# EAGLE design ft232rl_breakout (EAGLE 6.5.0)
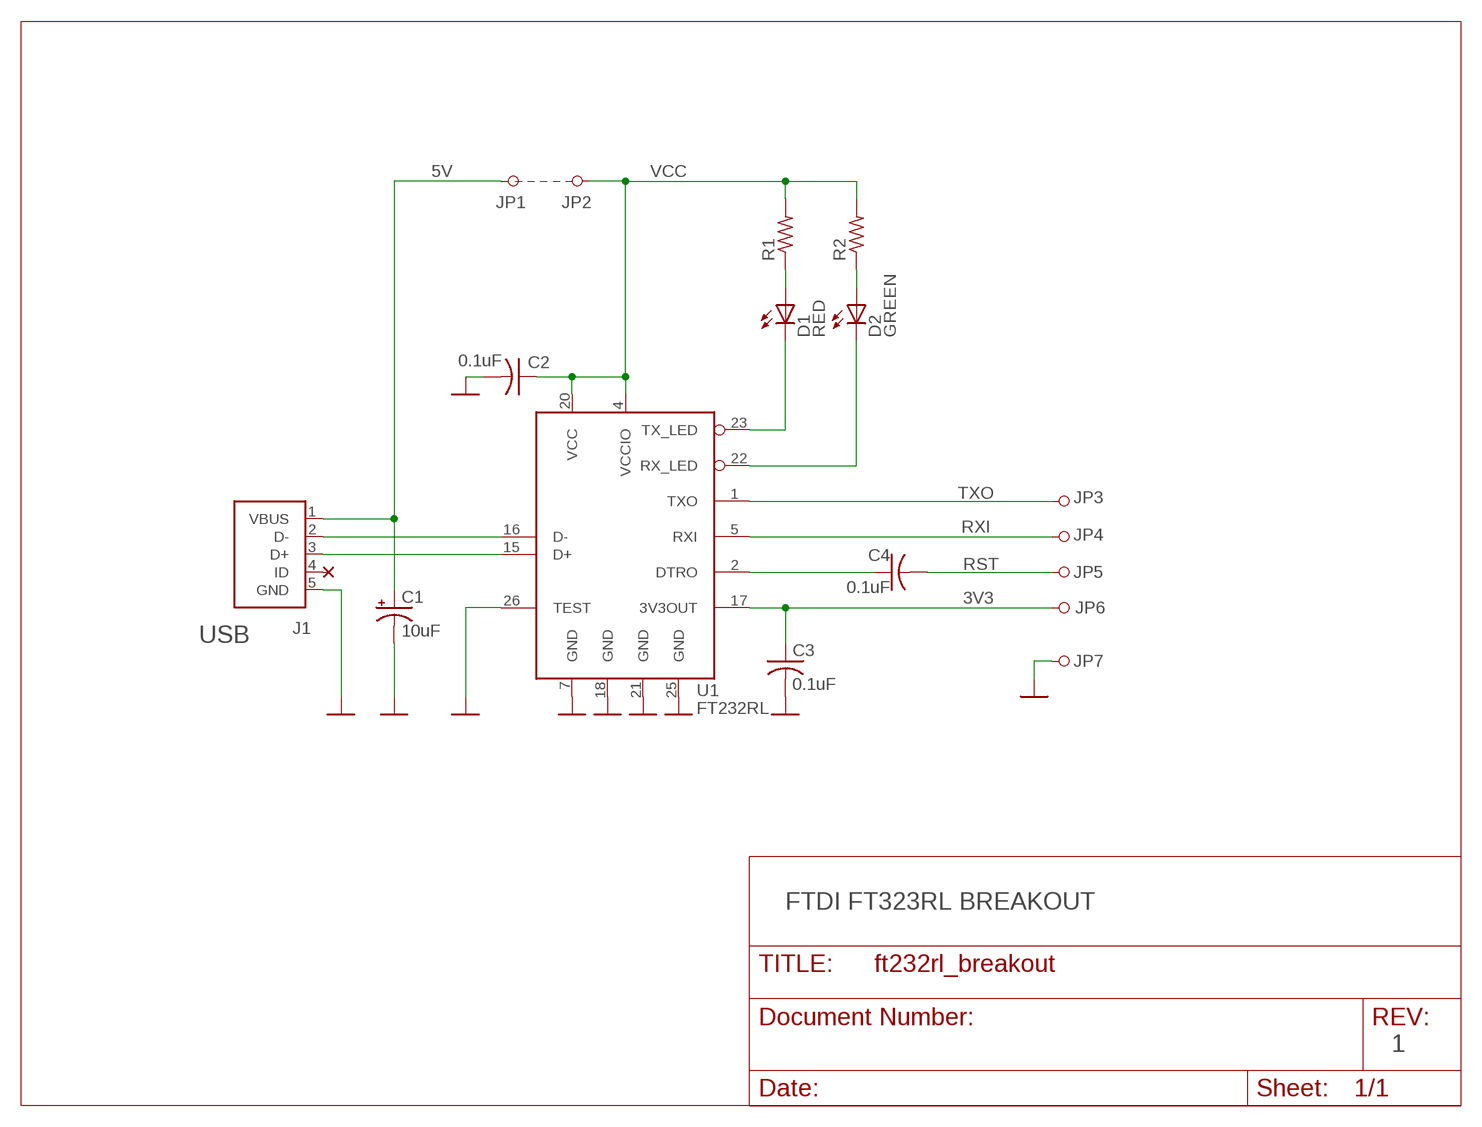
[diagram p0: schematic, sheet 1]

## Parts
C1  10uF  CPOL-USA/3216-18R  [A/3216-18R]
C2  0.1uF  C-USC0402K  [C0402K]
C3  0.1uF  C-USC0402K  [C0402K]
C4  0.1uF  C-USC0402K  [C0402K]
D1  RED  LED  [LED_0402]
D2  GREEN  LED  [LED_0402]
J1  USB  [USB-MICRO-ZX62RD-AB-5P8]
JP1  PINHD-1X1  [1X01]
JP2  PINHD-1X1  [1X01]
JP3  PINHD-1X1  [1X01]
JP4  PINHD-1X1  [1X01]
JP5  PINHD-1X1  [1X01]
JP6  PINHD-1X1  [1X01]
JP7  PINHD-1X1  [1X01]
R1  R-US_R0402  [R0402]
R2  R-US_R0402  [R0402]
U1  FT232RL  [SSOP28DB]

## Nets
3V3: C3.1 JP6.1 U1.17(3V3OUT)
5V: C1.+ J1.1(VBUS) JP1.1
GND: C1.- C2.2 C3.2 J1.5(GND) JP7.1 U1.7(GND) U1.18(GND) U1.21(GND) U1.25(GND) U1.26(TEST)
N$2: D1.C U1.23(TX_LED)
N$3: D2.C U1.22(RX_LED)
N$4: D1.A R1.1
N$5: D2.A R2.1
N$10: J1.3(D+) U1.15(D+)
N$11: C4.1 U1.2(DTRO)
N$15: J1.2(D-) U1.16(D-)
RST: C4.2 JP5.1
RXI: JP4.1 U1.5(RXI)
TXO: JP3.1 U1.1(TXO)
VCC: C2.1 JP2.1 R1.2 R2.2 U1.4(VCCIO) U1.20(VCC)
Unconnected: J1.4(ID)

## Notes on the sheet
- USB
- FTDI FT323RL BREAKOUT
- 1

## Library data of the parts
C1 = ft232rl_breakout:CPOL-US
C2-C4 = ft232rl_breakout:C-US: CAPACITOR, American symbol
D1 D2 = ft232rl_breakout:LED
J1 = ft232rl_breakout:USB
JP1-JP7 = ft232rl_breakout:PINHD-1X1: PIN HEADER
R1 R2 = ft232rl_breakout:R-US_: RESISTOR, American symbol
U1 = ft232rl_breakout:FT232RL

## Net classes
1 power: width 0.254 mm

## Board
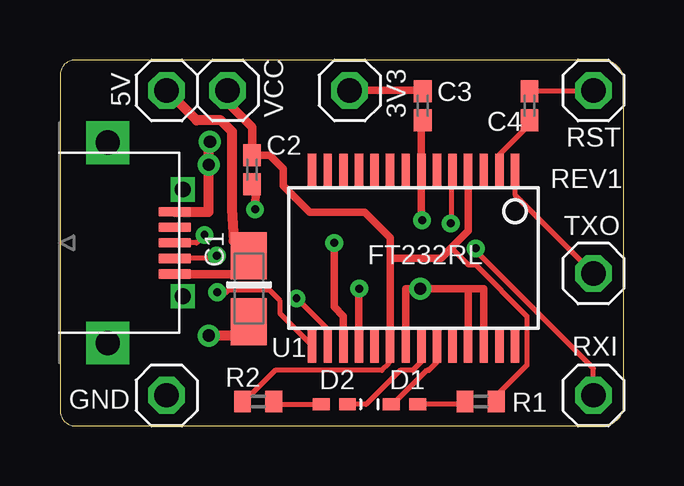
[diagram p1: board, top side]
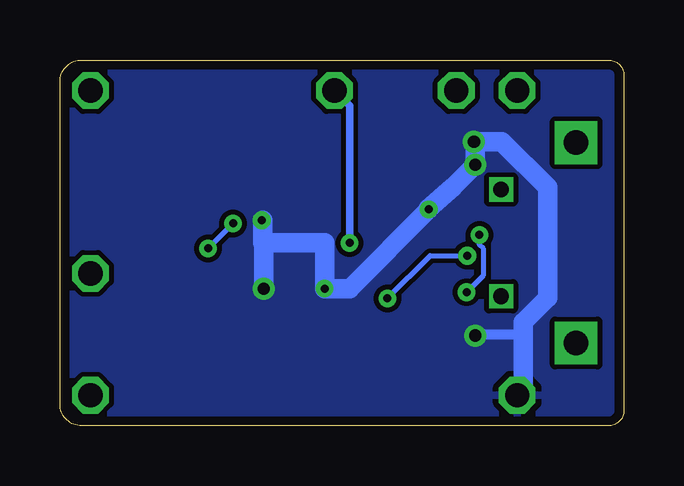
[diagram p2: board, bottom side, seen from below]

Size 23.5 x 15.24 mm. Coordinates in mm from the lower left corner, seen from the top.
Outline: 0,14.61 0,0.64 arc90 0.64,0 22.6,0 arc90 23.5,0.9 23.5,14.34 arc90 22.6,15.24 0.64,15.24 arc90 0,14.61
Copper layers (1*16): Top 0.035mm / dielectric 1.5mm / Bottom 0.035mm
Design rules "default *": minimum track width 8mil, minimum drill 13mil, track to track 8mil, track to pad 8mil, pad to pad 8mil, via to via 8mil, smd to smd 8mil, copper to edge 15mil, drill to drill 8mil, minimum pad ring 7mil, minimum via ring 8mil, stop-mask expansion 4mil, vias tented up to drill 20mil, thermal gap 10mil

### Footprints (pad centres in the part's own frame; a part is rotated, then mirrored left to right if it is on the bottom)
A/3216-18R = smd 1.95 x 1.5: + 1.375,0; - -1.375,0
C0402K = smd 0.925 x 0.74: 1 -0.6,0; 2 0.6,0
LED_0402 = smd 0.7 x 0.5: A -0.55,0; C 0.55,0
USB-MICRO-ZX62RD-AB-5P8 = smd 0.4 x 1.35: 1 1.3,5.425; 2 0.65,5.425; 3 0,5.425; 4 -0.65,5.425; 5 -1.3,5.425 | drill 1.016 pad 1.778 square: A -4.175,2.625; D 4.175,2.625 | drill 0.65 pad 0.914 square: B -2.225,5.75; C 2.225,5.75
1X01 = drill 1.016 octagon: 1 0,0
R0402 = smd 0.7 x 0.9: 1 -0.65,0; 2 0.65,0
SSOP28DB = smd 0.348 x 1.397: 1 -4.225,-3.656; 2 -3.575,-3.656; 3 -2.925,-3.656; 4 -2.275,-3.656; 5 -1.625,-3.656; 6 -0.975,-3.656; 7 -0.325,-3.656; 8 0.325,-3.656; 9 0.975,-3.656; 10 1.625,-3.656; 11 2.275,-3.656; 12 2.925,-3.656; 13 3.575,-3.656; 14 4.225,-3.656; 15 4.225,3.656; 16 3.575,3.656; 17 2.925,3.656; 18 2.275,3.656; 19 1.625,3.656; 20 0.975,3.656; 21 0.325,3.656; 22 -0.325,3.656; 23 -0.975,3.656; 24 -1.625,3.656; 25 -2.275,3.656; 26 -2.925,3.656; 27 -3.575,3.656; 28 -4.225,3.656

### Placement (x,y rotation side)
C1  7.87,5.71 90 top
C2  8,10.67 270 top
C3  15.11,13.34 270 top
C4  19.56,13.34 90 top
D1  14.35,0.89 180 top
D2  11.43,0.89 0 top
J1  -0.63,7.62 270 top
JP1  4.45,13.97 0 top
JP2  6.99,13.97 0 top
JP3  22.22,6.35 0 top
JP4  22.22,1.27 0 top
JP5  22.22,13.97 0 top
JP6  12.07,13.97 0 top
JP7  4.45,1.27 0 top
R1  17.53,1.02 0 top
R2  8.25,1.02 180 top
U1  14.73,6.99 180 top

### Tracks (layer width: path | path; a pad name or v marks a point on that pad's centre or on a via)
3V3  (via drill 0.33)
  Top 0.305: C3.1 15.11,13.97 JP6.1 | U1.17 11.81,4.57 11.43,4.95 v11.43,7.62
  Bottom 0.305: v11.43,7.62 11.43,13.34 JP6.1
5V
  Top 0.356: J1.1 8.23,6.32 8.25,6.35 8.25,6.71 C1.+ 7.75,7.22
  Top 0.406: C1.+ 7.24,7.7 7.16,9.04 7.16,12.27 6.71,12.72 5.69,12.72 JP1.1
GND  (via drill 0.33, 0.51)
  Top 0.305: U1.26 17.65,5.71 17.01,5.71 | 17.01,5.71 U1.25 | U1.21 14.41,5.71 v15.01,5.71 17.01,5.71 | 15.06,8.56 U1.7 15.06,12.74 C3.2 | U1.18 12.46,5.71 v12.47,5.71
  Top 0.356: v8.13,9.02 8.16,9.91 C2.2 | C1.- 7.51,4.34 | J1.5
  Top 0.406: J1.5 6.2,8.92 v6.2,10.87 6.2,11.79 v6.25,11.84 | 7.51,4.34 7.51,3.76 v6.2,3.76
  Top 0.508: 15.06,8.56 v15.09,8.56
  Bottom 0.305: 15.06,7.62 15.01,7.62
  Bottom 0.406: 4.19,1.52 JP7.1 | 6.2,11.79 v6.25,11.84 | v6.2,3.76 6.2,3.81 4.19,3.81
  Bottom 0.813: 4.19,1.52 4.19,3.81 4.19,4.32 3.17,5.33 3.17,9.93 5.08,11.84 v6.25,11.84 | v6.2,10.87 6.2,11.79 | 8.15,9.04 7.14,9.93 6.17,10.9 | 15.06,8.56 15.06,7.62 | v15.01,5.71 15.01,7.62 12.46,7.62 12.46,5.71 | v8.13,9.02 11.43,5.71 v12.47,5.71
  pour Bottom: 0,15.24 23.5,15.24 23.5,0 0,0
N$2
  Top 0.203: D1.C 13.87,0.89 15.29,2.31 15.37,2.31 15.7,2.64 U1.23
N$3
  Top 0.203: D2.C 12.75,0.89 14.17,2.31 14.71,2.31 15.04,2.64 15.04,3.33 U1.22
N$4
  Top 0.203: D1.A 16.74,0.89 R1.1
N$5
  Top 0.203: D2.A 9.04,0.89 R2.1
N$10  (via drill 0.33)
  Top 0.203: J1.3 5.69,7.62 v6.02,7.95 | v6.55,5.56 6.93,5.56 7.01,5.64 8.74,5.64 9.17,5.21 9.17,4.67 10.49,3.35 U1.15
  Bottom 0.203: v6.02,7.95 6.02,7.54 5.84,7.37 5.84,6.27 v6.55,5.56
N$11
  Top 0.203: C4.1 19.56,12.55 18.31,11.3 U1.2
N$15  (via drill 0.33)
  Top 0.203: v6.53,7.09 6.43,6.99 4.8,6.99 J1.2 | v9.86,5.31 11.15,4.01 11.15,3.35 U1.16
  Bottom 0.203: v6.53,7.09 8.08,7.09 v9.86,5.31
RST
  Top 0.203: JP5.1 22.2,13.95 C4.2
RXI  (via drill 0.33)
  Top 0.203: v16.28,8.43 16.33,8.48 16.33,10.62 U1.5 | v17.32,7.39 17.32,7.29 22.22,2.39 JP4.1
  Bottom 0.203: v17.32,7.39 v16.28,8.43
TXO
  Top 0.203: JP3.1 18.97,9.6 18.97,10.62 U1.1
VCC
  Top 0.203: R2.2 7.67,1.02 8.97,2.31 13.41,2.31 13.69,2.59 13.69,3.2 U1.20 | 16.31,7.42 17.02,6.71 17.32,6.71 19.46,4.57 19.46,2.52 18.19,1.25 18.19,1.02 R1.2
  Top 0.305: U1.4 17.01,8.12 16.31,7.42 15.88,6.99 13.76,6.99 | C2.1 8.75,11.27 9.3,10.72 9.3,10.01 10.41,8.89 12.7,8.89 13.76,7.83 13.76,6.99 | U1.20 13.76,6.99
  Top 0.356: JP2.1 6.99,13.46 8,12.45 C2.1

### Text on the board
tPlace: 5V | VCC | 3V3 | RST | REV1 | TXO | FT232RL | RXI | GND